# Altium schematic sheet Power.SchDoc
size A
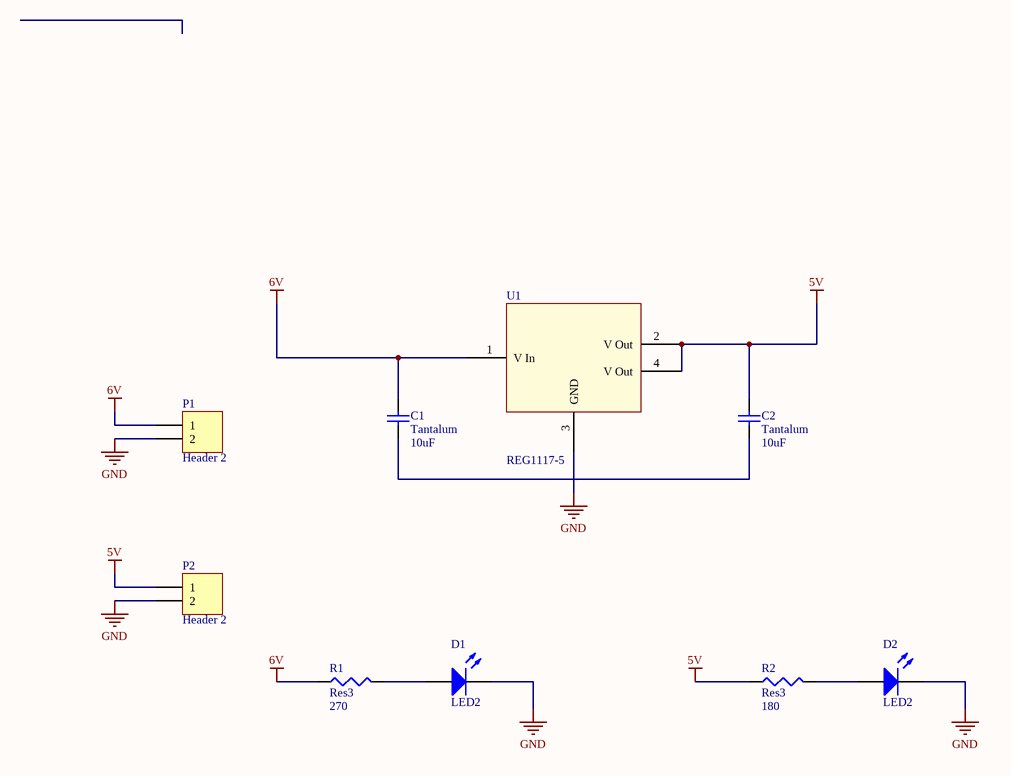
[diagram p0: Power.SchDoc]

## Parts
C1  Tantalum  value 10uF  [C1206]
C2  Tantalum  value 10uF  [C1206]
D1  LED2  [3.2X1.6X1.1]
D2  LED2  [3.2X1.6X1.1]
P1  Header 2  [HDR1X2]
P2  Header 2  [HDR1X2]
R1  Res3  value 270  [J1-0603]
R2  Res3  value 180  [J1-0603]
U1  REG1117-5  [SOT230P710X180-4N]

## Nets
5V: C2.2 P2.1 R2.1 U1.2(V_Out) U1.4(V_Out)
6V: C1.2 P1.1 R1.1 U1.1(V_In)
GND: D1.2(K) D2.2(K) P1.2 P2.2 U1.3(GND)
NetC1_1: C1.1 C2.1
NetD1_1: D1.1(A) R1.2
NetD2_1: D2.1(A) R2.2

## Library data of the parts
C1 C2 = Cap Semi: Capacitor (Semiconductor SIM Model); Published: 8-Jun-2000; LatestRevisionDate: 29-May-2009; LatestRevisionNote: IPC-7351 Footprint Added.; PackageReference: C1206; Publisher: Altium Limited; PackageDescription: Chip Capacitor
D1 D2 = LED2: Typical RED, GREEN, YELLOW, AMBER GaAs LED; Published: 8-Jun-2000; LatestRevisionDate: 17-Jul-2002; LatestRevisionNote: Re-released for DXP Platform.; PackageVersion: Feb-2002; PackageReference: 3.2X1.6X1.1; Publisher: Altium Limited; PackageDescription: SM LED; 2 Flat Leads
P1 P2 = Header 2: Header, 2-Pin; LatestRevisionDate: 17-Jul-2002; LatestRevisionNote: Re-released for DXP Platform.; Publisher: Altium Limited
R1 R2 = Res3: Resistor; Published: 8-Jun-2000; LatestRevisionDate: 29-May-2009; LatestRevisionNote: IPC-7351 Footprint Added.; PackageReference: J1-0603; Publisher: Altium Limited; PackageDescription: Chip Resistor
U1 = REG1117-5: REG1117-5, Voltage Regulator, 5V Out, 800mA